# Altium schematic sheet TC387_PWR.SchDoc
size A3; SheetNumber: 2; SheetTotal: 6
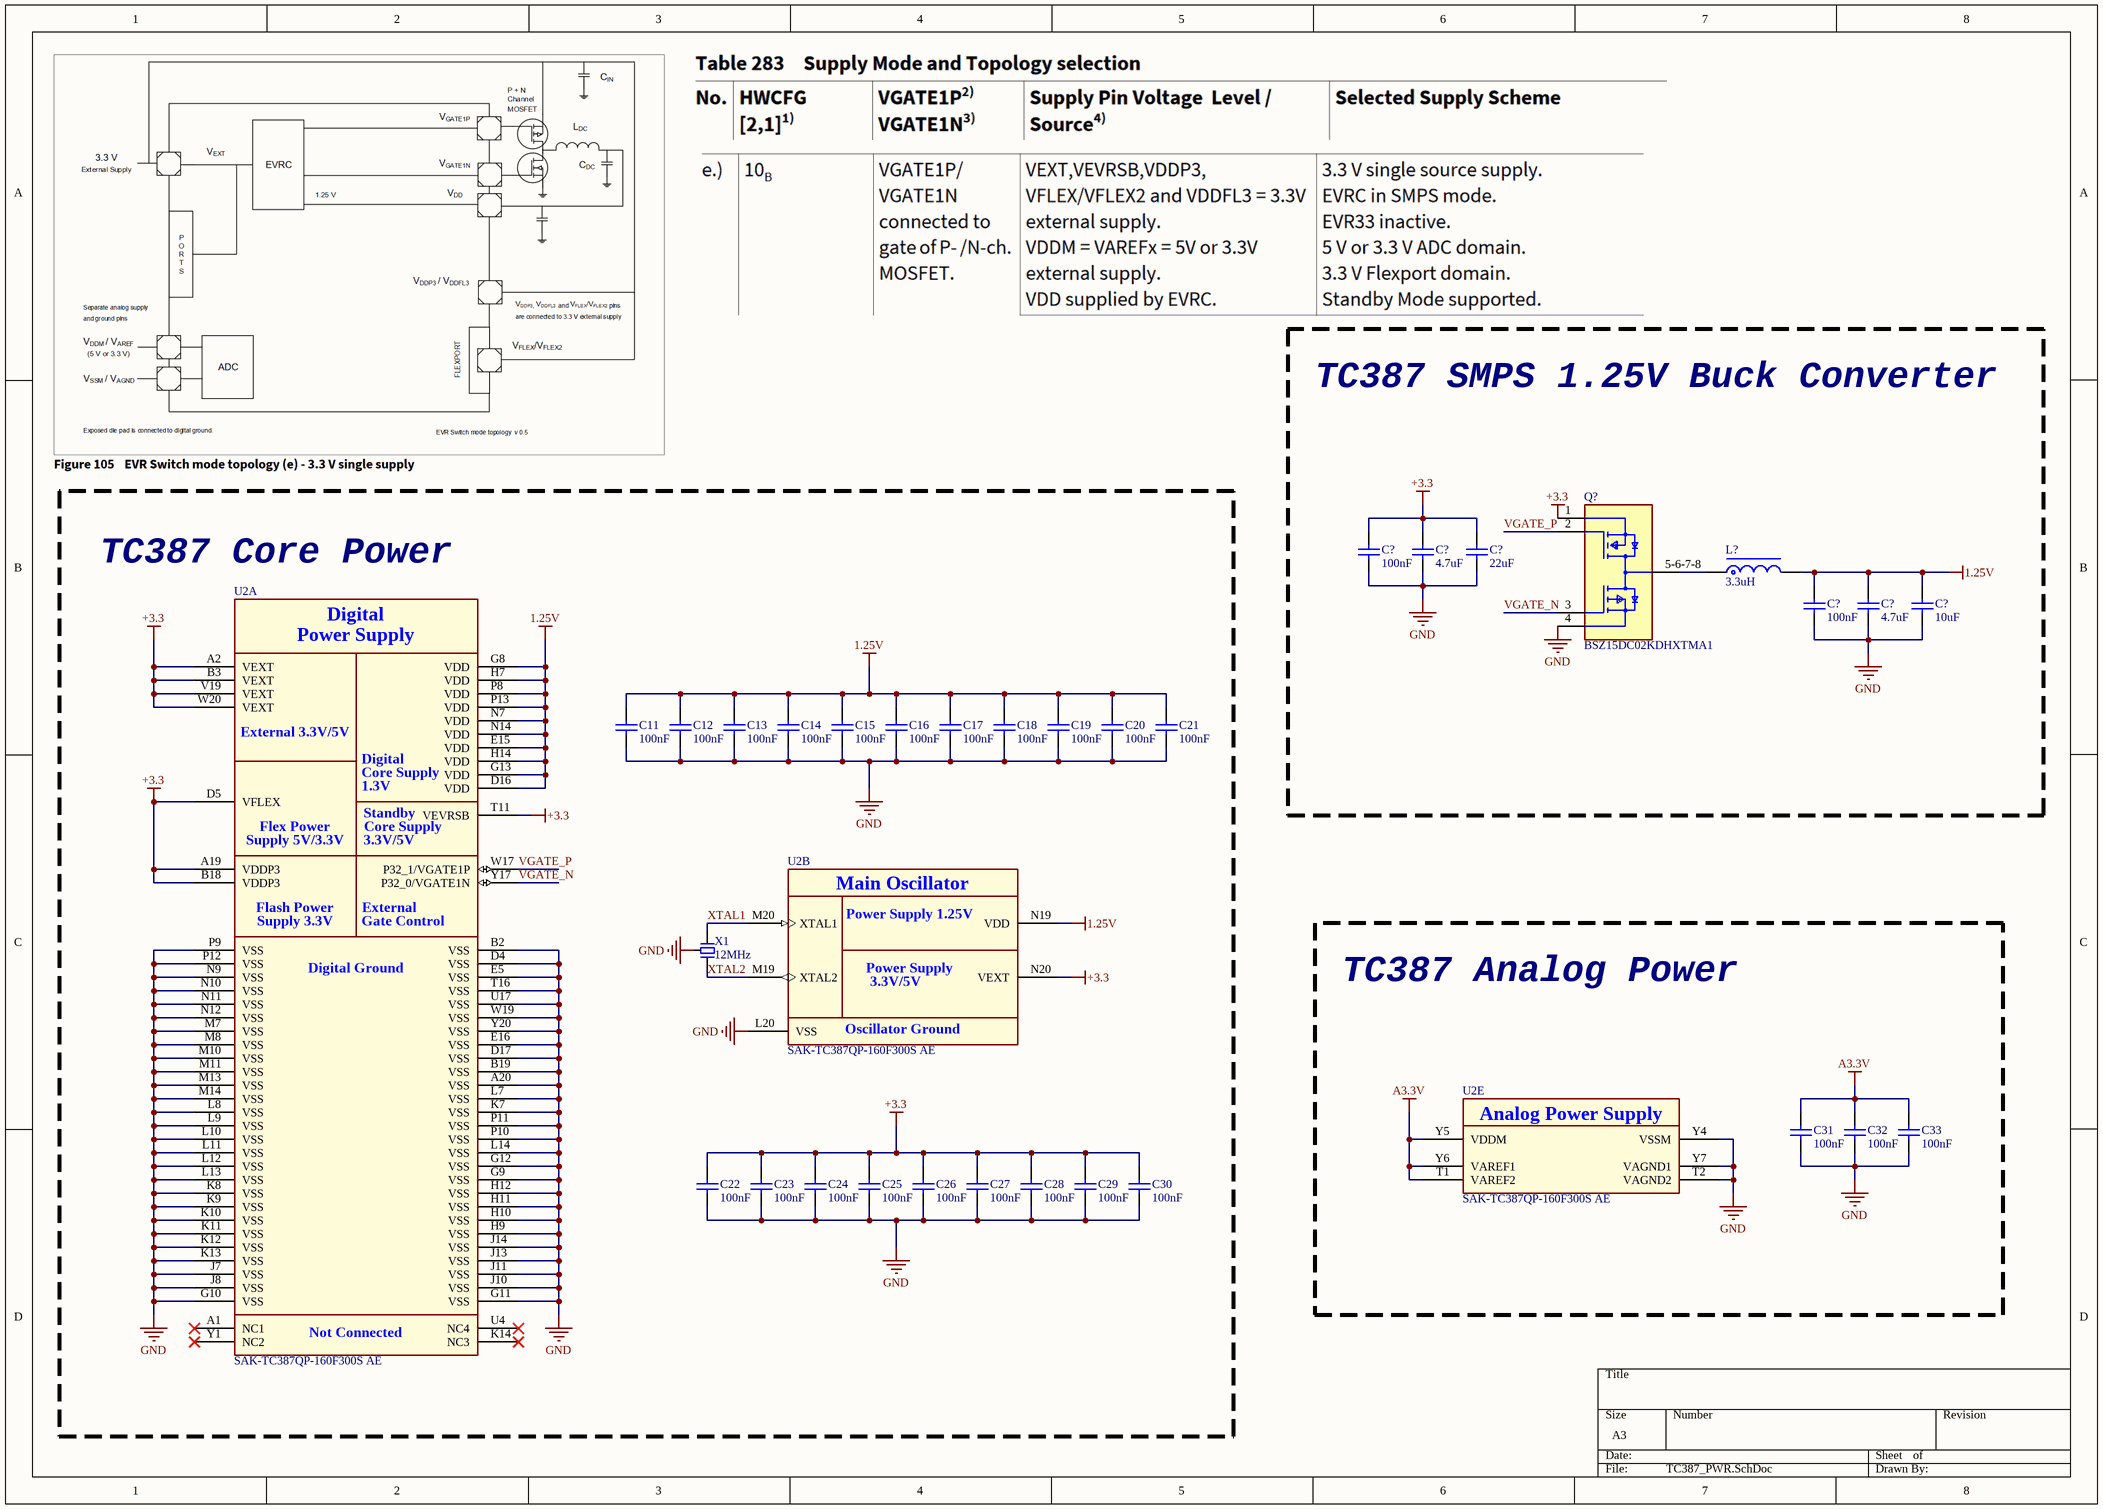
[diagram p0: TC387_PWR.SchDoc]

## Parts
(Parts that share a designator on the sheet are numbered #1, #2 ... from top to bottom, then left to right.)
C11  100nF  [C0402_M]
C12  100nF  [C0402_M]
C13  100nF  [C0402_M]
C14  100nF  [C0402_M]
C15  100nF  [C0402_M]
C16  100nF  [C0402_M]
C17  100nF  [C0402_M]
C18  100nF  [C0402_M]
C19  100nF  [C0402_M]
C20  100nF  [C0402_M]
C21  100nF  [C0402_M]
C22  100nF  [C0402_M]
C23  100nF  [C0402_M]
C24  100nF  [C0402_M]
C25  100nF  [C0402_M]
C26  100nF  [C0402_M]
C27  100nF  [C0402_M]
C28  100nF  [C0402_M]
C29  100nF  [C0402_M]
C30  100nF  [C0402_M]
C31  100nF  [C0603_L]
C32  100nF  [C0603_L]
C33  100nF  [C0603_L]
C?#1  100nF  [C0402_L]
C?#2  4.7uF  [C0402_L]
C?#3  22uF  [C0402_L]
C?#4  100nF  [C0603_L]
C?#5  4.7uF  [C0603_L]
C?#6  10uF  [C0603_L]
L?  3.3uH  [MPL-AY3020]
Q?  BSZ15DC02KDHXTMA1  [FP-PG-TSDSON-8-MFG]
U2  SAK-TC387QP-160F300S AE  [BGA292C80P20X20_1700X1700X170]  (parts A,B,E of 13)
X1  12MHz  [XTAL-3213-3P]

## Blocks framed on the sheet
TC387 SMPS 1.25V Buck Converter: C?#1-C?#6 L? Q?
TC387 Core Power: C11-C30 U2 X1
TC387 Analog Power: C31-C33 U2

## Nets
1.25V: C11.2 C12.2 C13.2 C14.2 C15.2 C16.2 C17.2 C18.2 C19.2 C20.2 C21.2 C?#4.2 C?#5.2 C?#6.2 L?.2 U2.D16(VDD) U2.E15(VDD) U2.G8(VDD) U2.G13(VDD) U2.H7(VDD) U2.H14(VDD) U2.N7(VDD) U2.N14(VDD) U2.N19(VDD) U2.P8(VDD) U2.P13(VDD)
+3.3: C22.2 C23.2 C24.2 C25.2 C26.2 C27.2 C28.2 C29.2 C30.2 C?#1.2 C?#2.2 C?#3.2 Q?.1(S1) U2.A2(VEXT) U2.A19(VDDP3) U2.B3(VEXT) U2.B18(VDDP3) U2.D5(VFLEX) U2.N20(VEXT) U2.T11(VEVRSB) U2.V19(VEXT) U2.W20(VEXT)
A3.3V: C31.2 C32.2 C33.2 U2.T1(VAREF2) U2.Y5(VDDM) U2.Y6(VAREF1)
GND: C11.1 C12.1 C13.1 C14.1 C15.1 C16.1 C17.1 C18.1 C19.1 C20.1 C21.1 C22.1 C23.1 C24.1 C25.1 C26.1 C27.1 C28.1 C29.1 C30.1 C31.1 C32.1 C33.1 C?#1.1 C?#2.1 C?#3.1 C?#4.1 C?#5.1 C?#6.1 Q?.4(S2) U2.A20(VSS) U2.B2(VSS) U2.B19(VSS) U2.D4(VSS) U2.D17(VSS) U2.E5(VSS) U2.E16(VSS) U2.G9(VSS) U2.G10(VSS) U2.G11(VSS) U2.G12(VSS) U2.H9(VSS) U2.H10(VSS) U2.H11(VSS) U2.H12(VSS) U2.J7(VSS) U2.J8(VSS) U2.J10(VSS) U2.J11(VSS) U2.J13(VSS) U2.J14(VSS) U2.K7(VSS) U2.K8(VSS) U2.K9(VSS) U2.K10(VSS) U2.K11(VSS) U2.K12(VSS) U2.K13(VSS) U2.L7(VSS) U2.L8(VSS) U2.L9(VSS) U2.L10(VSS) U2.L11(VSS) U2.L12(VSS) U2.L13(VSS) U2.L14(VSS) U2.L20(VSS) U2.M7(VSS) U2.M8(VSS) U2.M10(VSS) U2.M11(VSS) U2.M13(VSS) U2.M14(VSS) U2.N9(VSS) U2.N10(VSS) U2.N11(VSS) U2.N12(VSS) U2.P9(VSS) U2.P10(VSS) U2.P11(VSS) U2.P12(VSS) U2.T2(VAGND2) U2.T16(VSS) U2.U17(VSS) U2.W19(VSS) U2.Y4(VSSM) U2.Y7(VAGND1) U2.Y20(VSS) X1.2
VGATE_N: Q?.3(G2) U2.Y17(P32_0/VGATE1N)
VGATE_P: Q?.2(G1) U2.W17(P32_1/VGATE1P)
XTAL1: U2.M20(XTAL1) X1.1
XTAL2: U2.M19(XTAL2) X1.3
NetL?_1: L?.1 Q?.5-6-7-8(D1-D2)

Not connected (* = marked no-connect by the designer): U2 A1(NC1)* K14(NC3)* U4(NC4)* Y1(NC2)*

## Notes on the sheet
- (in symbol SAK-TC387QP-160F300S AE, part A) Digital; Power Supply; External 3.3V/5V; Core Supply; 1.3V; Standby; Flex Power; Supply 5V/3.3V; 3.3V/5V; Flash Power; External; Supply 3.3V; Gate Control; Digital Ground; Not Connected
- (in symbol SAK-TC387QP-160F300S AE, part B) Main Oscillator; Power Supply 1.25V; Power Supply; 3.3V/5V; Oscillator Ground
- (in symbol SAK-TC387QP-160F300S AE, part E) Analog Power Supply

## Library data of the parts
C11-C33 C?#1-C?#6 = C: 贴片电容/MLCC电容; BOM名称: 无极性贴片电容; 当前库版本V2023.5.31 @淘宝卖家:黄晶宝石: 最新版本发布https://item.taobao.com/item.htm?id=566775463719
L? = L-Molding Choke: 一体成型电感; 当前库版本V2023.5.31 @淘宝卖家:黄晶宝石: 最新版本发布https://item.taobao.com/item.htm?id=566775463719; BOM名称: 一体成型电感
Q? = CMP-32901-000666-1: MOSFET N/P-CH 20V 5.1/3.2A TDSON; Gate to Source Voltage (Vgs): 12V; Max Power Dissipation: 2.5W; Rds On Max: 55mR; Continuous Drain Current (ID): 3.2A; FET Type: N and P-Channel; Input Capacitance: 419pF; Max Operating Temperature: 175°C; Lead Free: Lead Free; Halogen Free: Halogen Free; Number of Pins: 8; Packaging: Tape and Reel; Min Operating Temperature: -55°C; Mount: Surface Mount; RoHS Compliant: Yes; Max Dual Supply Voltage: 20V; Drain to Source Voltage (Vdss): 20V
U2 = SAK-TC387QP-160F300S AE: 32-Bit Single-Chip Microcontroller; Manufacturer: Infineon Technologies; Manufacturer Order Number: SAK-TC387QP-160F300S AE; PackageReference: PG-LFBGA-292
X1 = XTAL-3P: 村田3脚无源晶振(谐振器）; BOM名称: 2脚无源晶振(谐振器）; 联系下单店铺卖家 免费帮你查找封装: 联系下单店铺卖家 免费技术支持